# EAGLE design 7segement2digits1badidea-mk-2 (EAGLE 6.5.0)
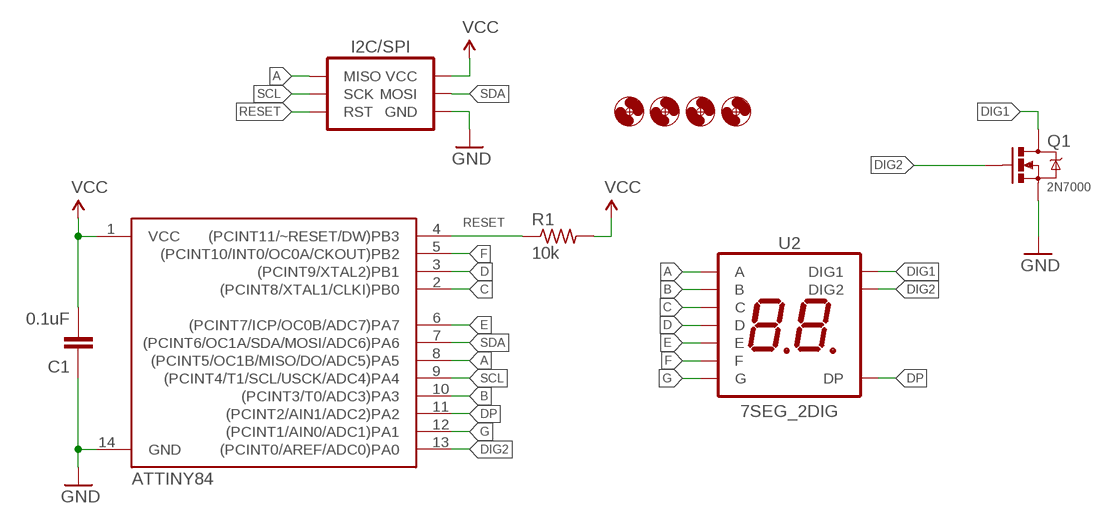
[diagram p0: schematic, sheet 1]

## Parts
C1  0.1uF  CAPACITOR-CERAMICC0805  [C0805]
H1  HOLE#2  [HOLE-#2]
H2  HOLE#2  [HOLE-#2]
H3  HOLE#2  [HOLE-#2]
H4  HOLE#2  [HOLE-#2]
I2C/SPI  AVR_SPI_PRG_6PTH_INLINE_I2C  [AVR_ISP_INLINE_PTH_I2C]
Q1  2N7000  MOSFET-NCHANNELBSS123LT1G  [SOT23]
R1  10k  RESISTORR0805  [R0805]
U1  ATTINY84  [SO14]
U2  7SEG_2DIG  [7SEG_2DIG_14MM]

## Nets
A: I2C/SPI.MISO U1.8((PCINT5/OC1B/MISO/DO/ADC5)PA5) U2.4(A)
B: U1.10((PCINT3/T0/ADC3)PA3) U2.3(B)
C: U1.2((PCINT8/XTAL1/CLKI)PB0) U2.9(C)
D: U1.3((PCINT9/XTAL2)PB1) U2.8(D)
DIG1: Q1.3(D) U2.5(DIG1)
DIG2: Q1.1(G) U1.13((PCINT0/AREF/ADC0)PA0) U2.10(DIG2)
DP: U1.11((PCINT2/AIN1/ADC2)PA2) U2.2(DP)
E: U1.6((PCINT7/ICP/OC0B/ADC7)PA7) U2.6(E)
F: U1.5((PCINT10/INT0/OC0A/CKOUT)PB2) U2.7(F)
G: U1.12((PCINT1/AIN0/ADC1)PA1) U2.1(G)
GND: C1.1 I2C/SPI.GND Q1.2(S) U1.14(GND)
RESET: I2C/SPI.RESET(RST) R1.1 U1.4((PCINT11/~RESET/DW)PB3)
SCL: I2C/SPI.SCK U1.9((PCINT4/T1/SCL/USCK/ADC4)PA4)
SDA: I2C/SPI.MOSI U1.7((PCINT6/OC1A/SDA/MOSI/ADC6)PA6)
VCC: C1.2 I2C/SPI.VCC R1.2 U1.1(VCC)

## Library data of the parts
C1 = A_butts:CAPACITOR-CERAMIC: CAPACITOR, European symbol
H1-H4 = A_butts:HOLE: MOUNTING HOLE with drill center marker
I2C/SPI = A_butts:AVR_SPI_PRG_6: AVR ISP 6 Pin This is the reduced ISP connector for AVR programming. Common on Arduino. This footprint will take up less PCB space and can be used with a 10-pin to 6-pin adapter such as SKU: BOB-08508 **Special note about "TEST_POINT" package. The stop mask is on the top side, so if you want your programming test points to be on the bottom of your board, make sure to place this package on the bottom side of the board. This also ensure that the orientation to program from the bottom side will be correct.
Q1 = A_butts:MOSFET-NCHANNEL: Common NMOSFET Parts MFG P/N Store ID Prod ID FDD8780 TRANS-09984 SI7820DN TRANS-11055 FDS6630A IC-08089 2N7002PW TRANS-11151 FQP30N06L COM-10213 TRANS-10060 BSS123LT1G TRANS-08345 BSS138 TRANS-00830 BS170 2N7000; PROD_ID: TRANS-08345
R1 = A_butts:RESISTOR: RESISTOR, American symbol
U1 = SparkFun-DigitalIC:ATTINY84: Atmel 14-pin 2/4/8kB flash uC; PROD_ID: IC-11285
U2 = A_butts:7SEG_2DIG

## Board
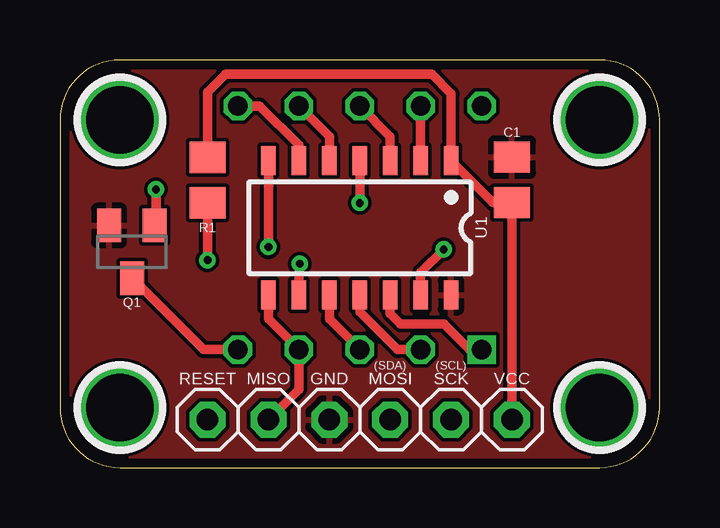
[diagram p1: board, top side]
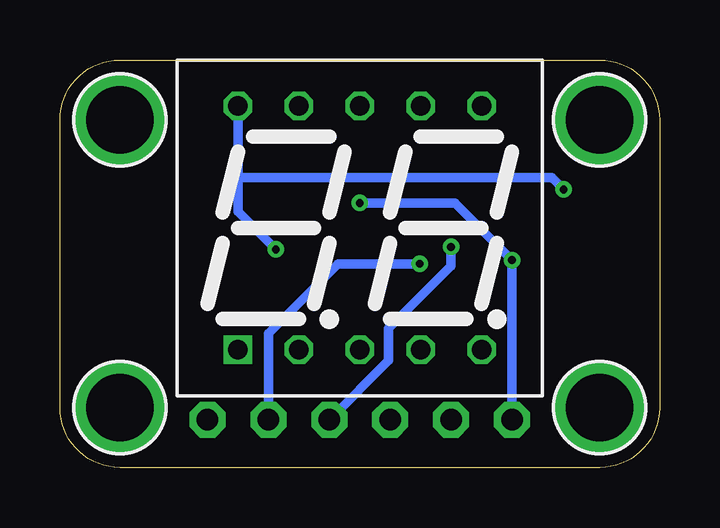
[diagram p2: board, bottom side, seen from below]

Size 25 x 17 mm. Coordinates in mm from the lower left corner, seen from the top.
Outline: 0,14.5 0,2.5 arc90 2.5,0 22.5,0 arc90 25,2.5 25,14.5 arc90 22.5,17 2.5,17 arc90 0,14.5
Copper layers (1*16): Top 0.0356mm / dielectric 1.5011mm / Bottom 0.0356mm
Design rules "LaenPCBOrder_2": minimum track width 6mil, minimum drill 13mil, track to track 6mil, track to pad 6mil, pad to pad 6mil, via to via 6mil, smd to smd 6mil, copper to edge 15mil, drill to drill 6mil, minimum pad ring 7mil, minimum via ring 7mil, stop-mask expansion 3mil, vias tented up to drill 20mil, thermal gap 10mil

### Footprints (pad centres in the part's own frame; a part is rotated, then mirrored left to right if it is on the bottom)
C0805 = smd 1.3 x 1.5: 1 -0.95,0; 2 0.95,0
HOLE-#2 = drill 2.8 pad 3.81: P$1 0,0
AVR_ISP_INLINE_PTH_I2C = drill 0.9 pad 1.5 octagon: GND 1.27,0; MISO 3.81,0; MOSI -1.27,0; RESET 6.35,0; SCK -3.81,0; VCC -6.35,0
SOT23 = smd 1 x 1.4: 1 -0.95,-1.1; 2 0.95,-1.1; 3 0,1.1
R0805 = smd 1.3 x 1.5: 1 -0.95,0; 2 0.95,0
SO14 = smd 0.6 x 1.2: 1 -3.81,-2.8; 2 -2.54,-2.8; 3 -1.27,-2.8; 4 0,-2.8; 5 1.27,-2.8; 6 2.54,-2.8; 7 3.81,-2.8; 8 3.81,2.8; 9 2.54,2.8; 10 1.27,2.8; 11 0,2.8; 12 -1.27,2.8; 13 -2.54,2.8; 14 -3.81,2.8
7SEG_2DIG_14MM = drill 0.8 square: 1 -5.08,-5.08 | drill 0.8 octagon: 2 -2.54,-5.08; 3 0,-5.08; 4 2.54,-5.08; 5 5.08,-5.08; 6 5.08,5.08; 7 2.54,5.08; 8 0,5.08; 9 -2.54,5.08; 10 -5.08,5.08

### Placement (x,y rotation side)
C1  18.85,12 270 top
H1  2.5,2.5 0 top
H2  2.5,14.5 0 top
H3  22.5,2.5 0 top
H4  22.5,14.5 0 top
I2C/SPI  12.5,2 180 top
Q1  3,9 180 top
R1  6.15,11.99 90 top
U1  12.5,10 180 top
U2  12.5,10 0 bottom

### Tracks (layer width: path | path; a pad name or v marks a point on that pad's centre or on a via)
A
  Top 0.4: U1.8 8.69,6.19 U2.4 9.96,3.27 I2C/SPI.MISO
B
  Top 0.4: U1.10 11.23,6.19 U2.3
C
  Top 0.4: U2.9 U1.2
D
  Top 0.4: U2.8 13.77,13.81 U1.3
DIG1
  Top 0.4: Q1.3 5.98,4.92 U2.5
DIG2  (via drill 0.33)
  Top 0.4: U1.13 15.04,8.14 v16,9.1 | Q1.1 4,10.15 v4,11.6
  Bottom 0.4: v16,9.1 17.58,10.68 17.58,12.1 | 17.58,12.1 U2.10 | v4,11.6 4.5,12.1 17.58,12.1
DP
  Top 0.4: U2.2 14.08,4.92 12.5,6.5 U1.11
E
  Top 0.4: U2.6 8.32,15.08 9.96,13.44 U1.6
F
  Top 0.4: U2.7 11.23,13.81 U1.5
G
  Top 0.4: U2.1 17.08,4.92 16,6 14.2,6 13.77,6.43 U1.12
GND
  pour Top: 22.5,0 2.5,0 arc-90 0,2.5 0,14.5 arc-90 2.5,17 22.5,17 arc-90 25,14.5 25,2.5 arc-90
RESET  (via drill 0.33)
  Top 0.4: U1.4 v12.5,11.04 | v6.15,8.65 R1.1
  Bottom 0.4: v12.5,11.04 8.54,11.04 v6.15,8.65 I2C/SPI.RESET
SCL  (via drill 0.33)
  Top 0.4: v10,8.5 9.96,8.46 U1.9
  Bottom 0.4: I2C/SPI.SCK 16.31,5.59 13.4,8.5 v10,8.5
SDA  (via drill 0.33)
  Top 0.4: v8.69,9.2 U1.7
  Bottom 0.4: I2C/SPI.MOSI 11.3,4.47 11.3,5.8 8.69,8.41 v8.69,9.2
VCC
  Top 0.4: I2C/SPI.VCC C1.2 18.06,11.05 U1.1 16.31,15.59 15.5,16.4 6.9,16.4 6.15,15.65 R1.2